# Altium project Sensor_LoRa_Flower_Watchdog.PrjPCB
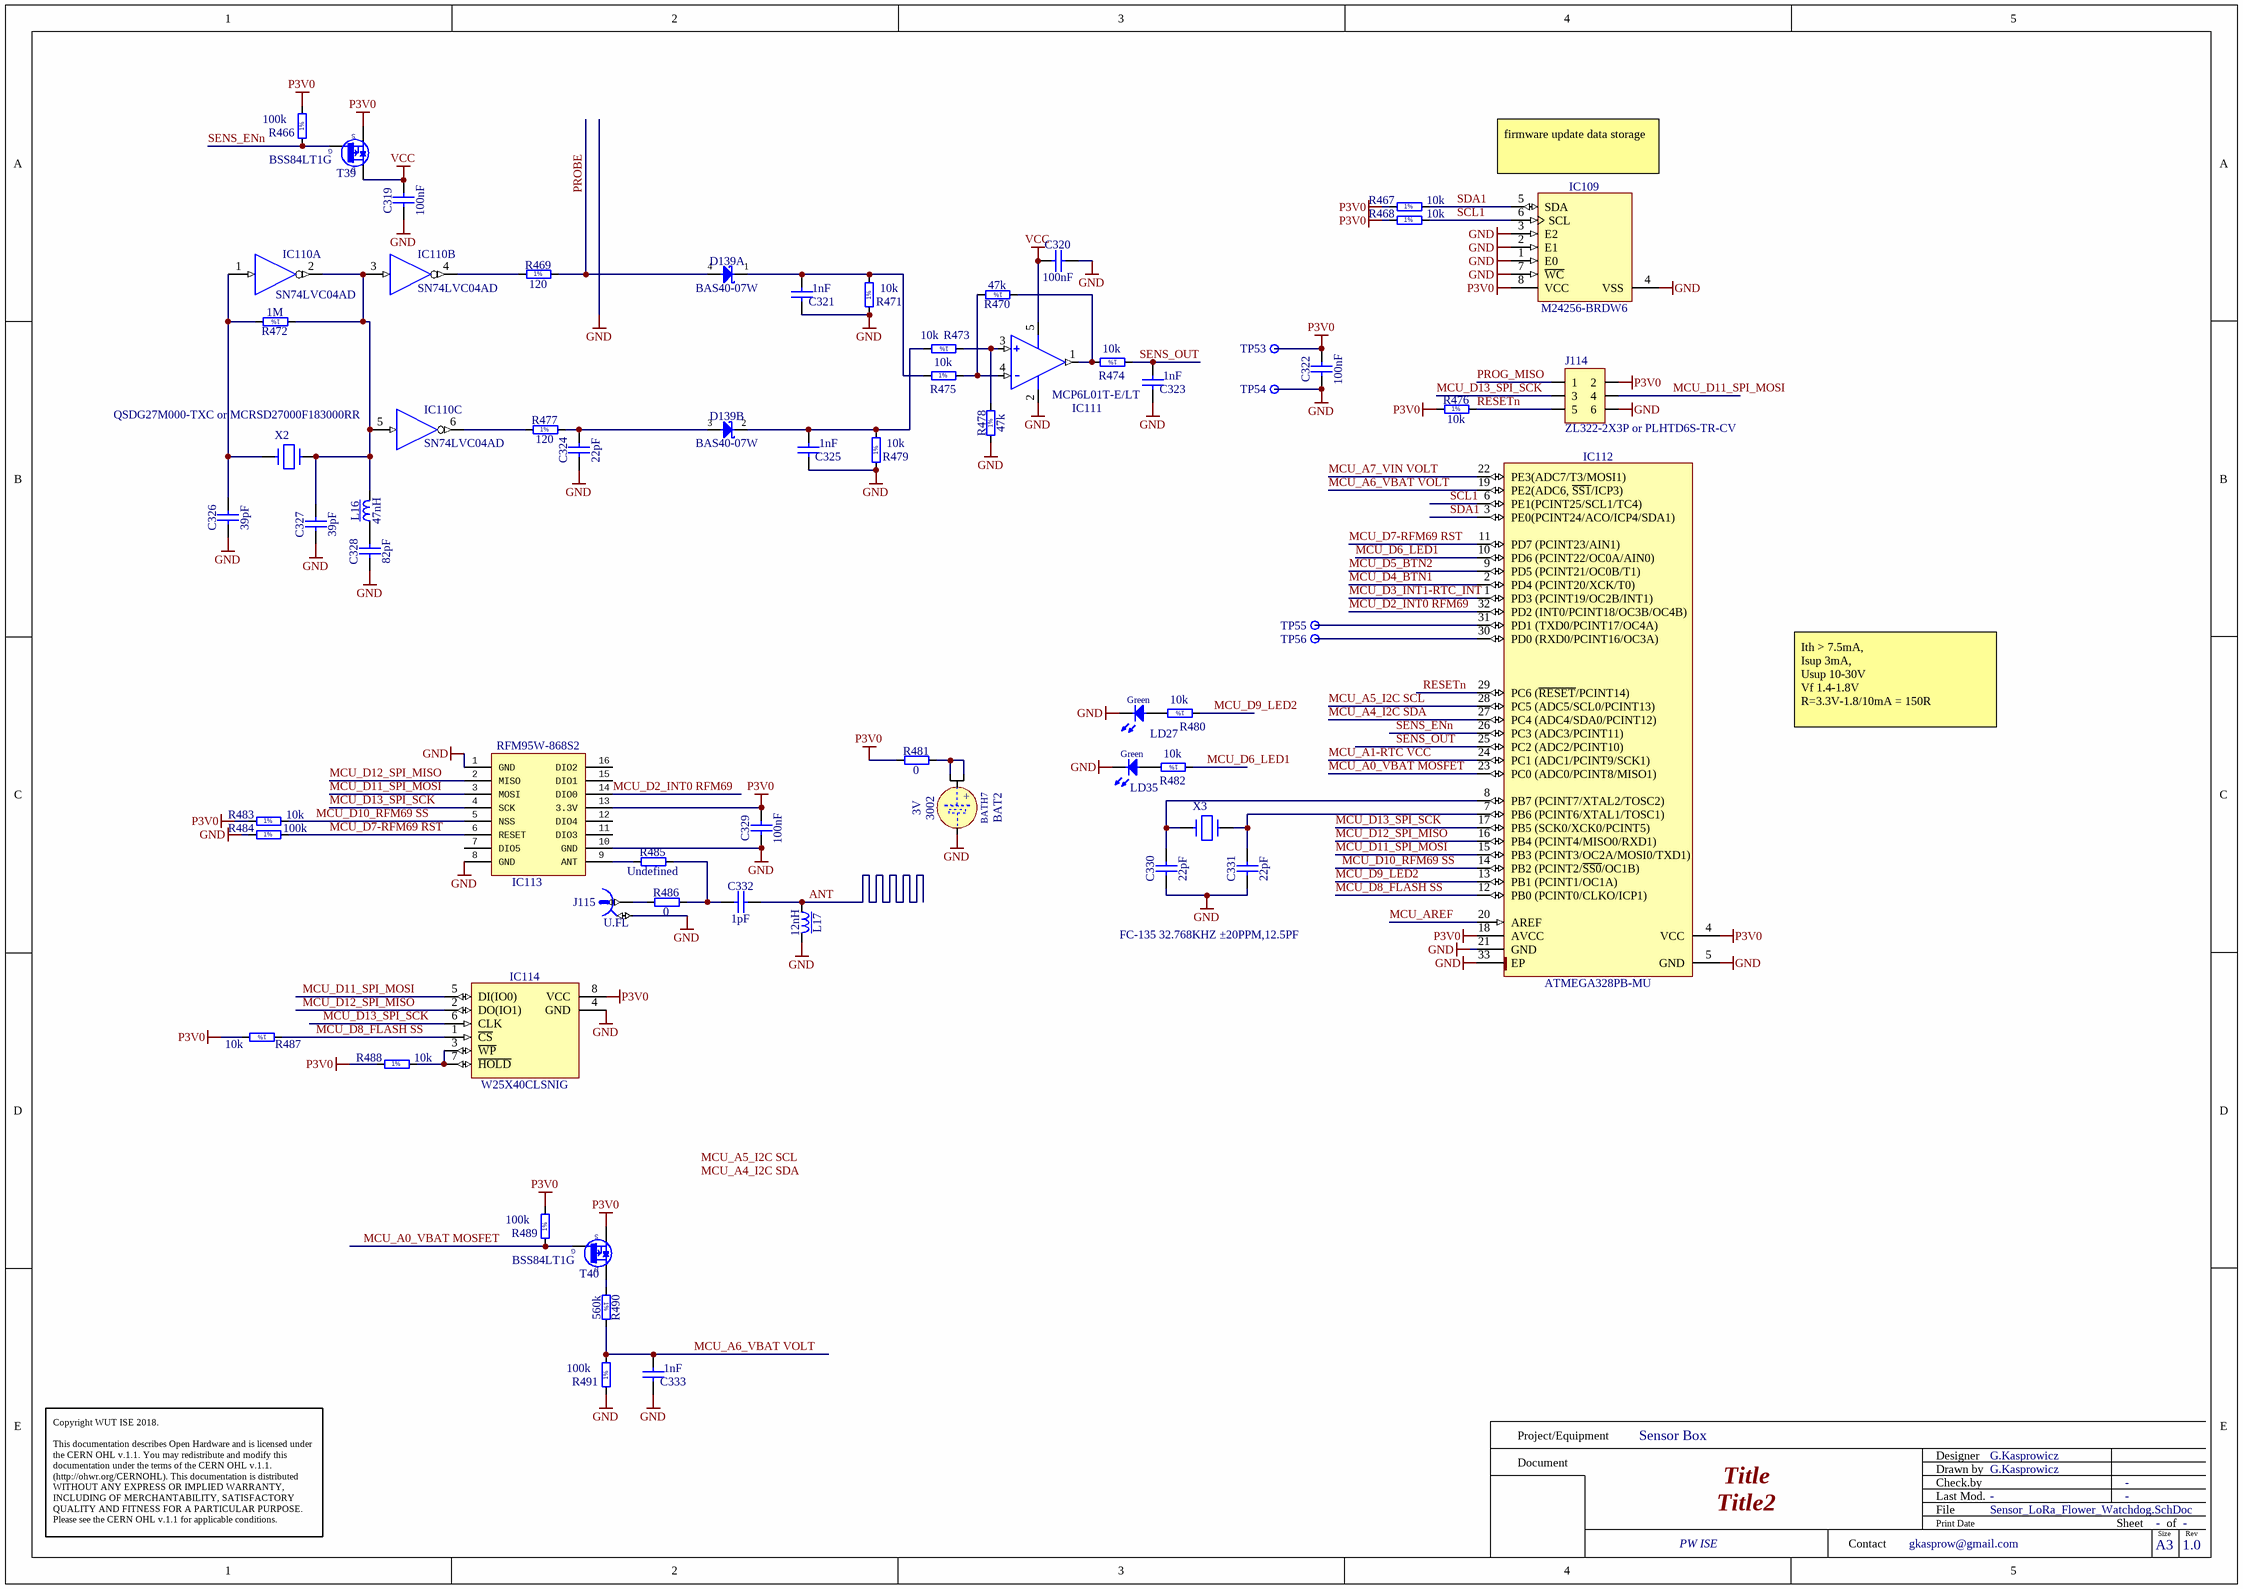
[diagram p0: Sensor_LoRa_Flower_Watchdog.SchDoc]
1 sheet, 64 parts. Net scope: global (net labels, ports and power ports of the same name join across sheets).
Board file: Sensor_LoRa_Flower_Watchdog.PCBDOC

## Sheet Sensor_LoRa_Flower_Watchdog.SchDoc: Title
size 420 x 297 mm; Author: G.Kasprowicz; CompanyName: WUT ISE; DrawnBy: G.Kasprowicz; Organization: WUT ISE; Address1: PW ISE; Address2: Nowowiejska 15/19 00-665 Warsaw; Address3: gkasprow@gmail.com; Revision: 1.0; SheetNumber: -; SheetTotal: -; ModifiedBy: -; CheckedDate: -; Title2: Title2; DivGrp: WUT ISE; Designer: G.Kasprowicz; ModifiedDate: -; ProjectName: Sensor Box

### Parts
BAT2  3V  [BAT_VARTA_CR2032]
BATH7  3002  [KEYSTONE 3002]
C319  100nF  [CAPC1005X55N]
C320  100nF  [CAPC1005X55N]
C321  1nF  [CAPC1005X55N]
C322  100nF  [CAPC1005X55N]
C323  1nF  [CAPC1005X55N]
C324  22pF  [CAPC1005X55N]
C325  1nF  [CAPC1005X55N]
C326  39pF  [CAPC1608X87N]
C327  39pF  [CAPC1608X87N]
C328  82pF  [CAPC2012X90N]
C329  100nF  [CAPC1005X55N]
C330  22pF  [CAPC1005X55N]
C331  22pF  [CAPC1005X55N]
C332  1pF  [CAPC1005X55N]
C333  1nF  [CAPC1005X55N]
D139  BAS40-07W  [INFINEON-PG-SOT343-4]  (parts A,B of 2)
IC109  M24256-BRDW6  [SOP65P640X120-8N]
IC110  SN74LVC04AD  [SOIC127P600X175-14N]  (parts A,B,C of 6)
IC111  MCP6L01T-E/LT  [SC70]
IC112  ATMEGA328PB-MU  [QFN50P500X500X100-33N-S325]
IC113  RFM95W-868S2  [RFM95W]
IC114  W25X40CLSNIG  [SOIC127P600X135-8N]
J114  ZL322-2X3P or PLHTD6S-TR-CV  [ZL322-2X3P]
J115  U.FL  [HIROSE_U.FL-R-SMT-1(10)]
L16  47nH  [IND_COILCRAFT_0805CS]
L17  12nH  [IND_COILCRAFT_0603HP]
LD27  Green  [LED_KINGBRIGHT_KPH-1608CGCK]
LD35  Green  [LED_KINGBRIGHT_KPH-1608CGCK]
R466  100k  [RESC1005X40N]
R467  10k  [RESC1005X40N]
R468  10k  [RESC1005X40N]
R469  120  [RESC1005X40N]
R470  47k  [RESC1005X40N]
R471  10k  [RESC1005X40N]
R472  1M  [RESC1005X40N]
R473  10k  [RESC1005X40N]
R474  10k  [RESC1005X40N]
R475  10k  [RESC1005X40N]
R476  10k  [RESC1005X40N]
R477  120  [RESC1005X40N]
R478  47k  [RESC1005X40N]
R479  10k  [RESC1005X40N]
R480  10k  [RESC1005X40N]
R481  0  [RESC1608X55N]
R482  10k  [RESC1005X40N]
R483  10k  [RESC1005X40N]
R484  100k  [RESC1005X40N]
R485  Undefined  [RESC1608X55N]
R486  0  [RESC1608X55N]
R487  10k  [RESC1005X40N]
R488  10k  [RESC1005X40N]
R489  100k  [RESC1005X40N]
R490  560k  [RESC1005X40N]
R491  100k  [RESC1005X40N]
T39  BSS84LT1G  [SOT95P240X110-3N]
T40  BSS84LT1G  [SOT95P240X110-3N]
TP53  Test Point  [TPS127]  (value not drawn)
TP54  Test Point  [TPS127]  (value not drawn)
TP55  Test Point  [TPS127]  (value not drawn)
TP56  Test Point  [TPS127]  (value not drawn)
X2  QSDG27M000-TXC or MCRSD27000F183000RR  [HC-49SM]
X3  FC-135 32.768KHZ ±20PPM,12.5PF  [XTAL_FC135]

### Nets
GND: BATH7.2(MINUS) C319.1 C320.2 C321.1 C322.1 C323.1 C324.1 C325.1 C326.1 C327.1 C328.1 C329.1 C330.1 C331.1 C333.1 IC109.1(E0) IC109.2(E1) IC109.3(E2) IC109.4(VSS) IC109.7(~{WC}) IC110.7(GND) IC111.2(V-) IC112.5(GND) IC112.21(GND) IC112.33(EP) IC113.1(GND) IC113.8(GND) IC113.10(GND) IC114.4(GND) J114.6 J115.2 L17.2 LD27.1(C) LD35.1(C) R471.1 R478.1 R479.1 R484.1 R491.1 TP54.1
P3V0: C322.2 C329.2 IC109.8(VCC) IC112.4(VCC) IC112.18(AVCC) IC113.13(3.3V) IC114.8(VCC) J114.2 R466.2 R467.1 R468.1 R476.1 R481.1 R483.1 R487.2 R488.1 R489.2 T39.2(S) T40.2(S) TP53.1
VCC: C319.2 C320.1 IC110.14(VCC) IC111.5(V+) T39.3(D)
ANT: C332.2 L17.1
MCU_A0_VBAT MOSFET: IC112.23(PC0_(ADC0/PCINT8/MISO1)) R489.1 T40.1(G)
MCU_A1-RTC VCC: IC112.24(PC1_(ADC1/PCINT9/SCK1))
MCU_A4_I2C SDA: IC112.27(PC4_(ADC4/SDA0/PCINT12))
MCU_A5_I2C SCL: IC112.28(PC5_(ADC5/SCL0/PCINT13))
MCU_A6_VBAT VOLT: C333.2 IC112.19(PE2(ADC6,_~{SS1}/ICP3)) R490.2 R491.2
MCU_A7_VIN VOLT: IC112.22(PE3(ADC7/T3/MOSI1))
MCU_AREF: IC112.20(AREF)
MCU_D2_INT0 RFM69: IC112.32(PD2_(INT0/PCINT18/OC3B/OC4B)) IC113.14(DIO0)
MCU_D3_INT1-RTC_INT: IC112.1(PD3_(PCINT19/OC2B/INT1))
MCU_D4_BTN1: IC112.2(PD4_(PCINT20/XCK/T0))
MCU_D5_BTN2: IC112.9(PD5_(PCINT21/OC0B/T1))
MCU_D6_LED1: IC112.10(PD6_(PCINT22/OC0A/AIN0)) R482.1
MCU_D7-RFM69 RST: IC112.11(PD7_(PCINT23/AIN1)) IC113.6(RESET) R484.2
MCU_D8_FLASH SS: IC112.12(PB0_(PCINT0/CLKO/ICP1)) IC114.1(~{CS}) R487.1
MCU_D9_LED2: IC112.13(PB1_(PCINT1/OC1A)) R480.1
MCU_D10_RFM69 SS: IC112.14(PB2_(PCINT2/~{SS0}/OC1B)) IC113.5(NSS) R483.2
MCU_D11_SPI_MOSI: IC112.15(PB3_(PCINT3/OC2A/MOSI0/TXD1)) IC113.3(MOSI) IC114.5(DI(IO0)) J114.4
MCU_D12_SPI_MISO: IC112.16(PB4_(PCINT4/MISO0/RXD1)) IC113.2(MISO) IC114.2(DO(IO1))
MCU_D13_SPI_SCK: IC112.17(PB5_(SCK0/XCK0/PCINT5)) IC113.4(SCK) IC114.6(CLK) J114.3
PROBE: D139.4(A) R469.2
PROG_MISO: J114.1
RESETn: IC112.29(PC6_(~{RESET}/PCINT14)) J114.5 R476.2
SCL1: IC109.6(SCL) IC112.6(PE1(PCINT25/SCL1/TC4)) R468.2
SDA1: IC109.5(SDA) IC112.3(PE0(PCINT24/ACO/ICP4/SDA1)) R467.2
SENS_ENn: IC112.26(PC3_(ADC3/PCINT11)) R466.1 T39.1(G)
SENS_OUT: C323.2 IC112.25(PC2_(ADC2/PCINT10)) R474.1
NetBATH7_1a: BATH7.1a(PLUS) BATH7.1b(PLUS) R481.2
NetC321_2: C321.2 D139.1(C) R471.2 R475.1
NetC324_2: C324.2 D139.3(C) R477.2
NetC325_2: C325.2 D139.2(A) R473.2 R479.2
NetC326_2: C326.2 IC110.1(A) R472.2 X2.1
NetC327_2: C327.2 IC110.2(~{O}) IC110.3(A) IC110.5(A) L16.2 R472.1 X2.2
NetC328_2: C328.2 L16.1
NetC330_2: C330.2 IC112.8(PB7_(PCINT7/XTAL2/TOSC2)) X3.1
NetC331_2: C331.2 IC112.7(PB6_(PCINT6/XTAL1/TOSC1)) X3.2
NetC332_1: C332.1 R485.2 R486.2
NetIC110_4: IC110.4(~{O}) R469.1
NetIC110_6: IC110.6(~{O}) R477.1
NetIC111_1: IC111.1(OUT) R470.1 R474.2
NetIC111_3: IC111.3(IN+) R473.1 R478.2
NetIC111_4: IC111.4(in-) R470.2 R475.2
NetIC112_30: IC112.30(PD0_(RXD0/PCINT16/OC3A)) TP56.1
NetIC112_31: IC112.31(PD1_(TXD0/PCINT17/OC4A)) TP55.1
NetIC113_9: IC113.9(ANT) R485.1
NetIC114_3: IC114.3(~{WP}) IC114.7(~{HOLD}) R488.2
NetJ115_1: J115.1 R486.1
NetLD27_2: LD27.2(A) R480.2
NetLD35_2: LD35.2(A) R482.2
NetR490_1: R490.1 T40.3(D)

Not connected (* = marked no-connect by the designer): IC113 7(DIO5) 11(DIO3) 12(DIO4) 15(DIO1) 16(DIO2)

### Notes on the sheet
- (near IC109) firmware update data storage
- Ith > 7.5mA,
  Isup 3mA,
  Usup 10-30V
  Vf 1.4-1.8V
  R=3.3V-1.8/10mA = 150R
- Labels drawn without touching a wire or pin: MCU_A4_I2C SDA, MCU_A5_I2C SCL
- Project/Equipment
- Document
- Designer
- Drawn by
- Check.by
- Copyright WUT ISE 2018.
  This documentation describes Open Hardware and is licensed under the CERN OHL v.1.1. You may redistribute and modify this documentation under the terms of the CERN OHL v.1.1. (http://ohwr.org/CERNOHL). This documentation is distributed WITHOUT ANY EXPRESS OR IMPLIED WARRANTY, INCLUDING OF MERCHANTABILITY, SATISFACTORY QUALITY AND FITNESS FOR A PARTICULAR PURPOSE. Please see the CERN OHL v.1.1 for applicable conditions.
- Contact
- File
- Last Mod.
- Print Date
- Sheet
- Size
- A3
- of
- Rev
- (in symbol BAT_VARTA_CR2032) +
- (in symbol BATTERY_HOLD_CR2032_SMD) +
- (in symbol R0402_1M_1%_0.0625W_100PPM) 1%
- (in symbol R0402_10K_1%_0.0625W_100PPM) 1%
- (in symbol R0402_47K_1%_0.0625W_100PPM) 1%
- (in symbol R0402_100K_1%_0.0625W_100PPM) 1%
- (in symbol R0402_120R_1%_0.0625W_100PPM) 1%
- (in symbol R0402_560K_1%_0.0625W_100PPM) 1%

### Library data of the parts
BAT2 = BAT_VARTA_CR2032: Battery for use only with Socket Holder; Part Description: 20x3.2mm Lithium Coin Cells Type CR2032; Manufacturer: VARTA; Manufacturer Part Number: 6032101501; PressFit: No; Power: 230mAh; Part Number: BAT_VARTA_CR2032; Component Kind: Standard; Component Type: Standard; Pin Count: 0; PackageDescription: CR2032, 20mm Diameter x 3.2mm  Height Lithium Coin Cells; Family: Battery; Mounted: Yes; Socket: Yes; SMD: No; Sense: No; Value: 3V; ComponentHeight: 3.2mm; HelpURL: \\cern.ch\dfs\Applications\Altium\Datasheets\BAT_VARTA_CR2032.pdf; Author: CERN DEM JLC; CreateDate: 20/10/2009; LatestRevisionDate: 20/10/2009
BATH7 = BATTERY_HOLD_CR2032_SMD: Battery Holder Keystone 3002; Part Number: BATH_KEYSTONE_3000; Part Description: KEYSTONE 3002 CR2032 BATTERY HOLDER; PressFit: No; Component Kind: Standard; Component Type: Standard; Pin Count: 3; PackageDescription: KEYSTONE 3002 CR2032 BATTERY HOLDER; Family: Battery; Mounted: Yes; Socket: No; SMD: Yes; Sense: No; Manufacturer: KEYSTONE; Manufacturer Part Number: 3002; ComponentHeight: 3.17mm; HelpURL: \\cern.ch\dfs\Applications\Altium\Datasheets\BATH_KEYSTONE_3000.pdf; Author: GK; CreateDate: 17/04/2012; LatestRevisionDate: 07/06/2017
C319 C320 C322 C329 = CC0402_100NF_16V_10%_X5R: Non-polarised capacitor; Part Description: SMD Multilayer Chip Ceramic Capacitor; Manufacturer: GENERIC; Manufacturer1 Part Number: GRM155R61C104KA88D; Voltage: 16V; TC: X5R; Tolerance: ±10%; Part Number: CC0402_100NF_16V_10%_X5R; Component Kind: Standard; Component Type: Standard; Pin Count: 2; Value: 100nF; Status: None; Manufacturer Part Number: CC0402_100NF_16V_10%_X5R; Case: 0402; Mounted: Yes; Socket: No; SMD: Yes; Sense: No; Manufacturer1 Example: MURATA; Manufacturer1 ComponentHeight: 0.55mm; HelpURL: \\cern.ch\dfs\Applications\Altium\Datasheets\CC0402_X5R_MURATA_GRM.pdf; Author: CERN DEM JLC; CreateDate: 10.12.2013; LatestRevisionDate: 10.12.2013
C321 C323 C325 C333 = CC0402_1NF_50V_10%_X7R: Non-polarised capacitor; Part Description: SMD Multilayer Chip Ceramic Capacitor; Manufacturer: GENERIC; Manufacturer1 Part Number: 223858715623; Voltage: 50V; TC: X7R; Tolerance: ±10%; Part Number: CC0402_1NF_50V_10%_X7R; Component Kind: Standard; Component Type: Standard; Pin Count: 2; Value: 1nF; Status: Not Recommended; Manufacturer Part Number: CC0402_1NF_50V_10%_X7R; Case: 0402; Mounted: Yes; Socket: No; SMD: Yes; Sense: No; Manufacturer1 Example: PHYCOMP; Manufacturer1 ComponentHeight: 0.55mm; HelpURL: \\cern.ch\dfs\Applications\Altium\Datasheets\CC0402_X7R_PHYCOMP.pdf; Author: CERN DEM JLC; CreateDate: 03/12/2007; LatestRevisionDate: 03/12/2007
C324 C330 C331 = CC0402_22PF_50V_5%_C0G: Non-polarised capacitor; Part Description: SMD Multilayer Chip Ceramic Capacitor; Manufacturer: GENERIC; Manufacturer1 Part Number: C0402C220J5GACTU; Voltage: 50V; TC: C0G/NP0; Tolerance: ±5%; Part Number: CC0402_22PF_50V_5%_C0G; Component Kind: Standard; Component Type: Standard; Pin Count: 2; Value: 22pF; Status: Preferred; Manufacturer Part Number: CC0402_22PF_50V_5%_C0G; Case: 0402; Mounted: Yes; Socket: No; SMD: Yes; Sense: No; Manufacturer1 Example: KEMET; Manufacturer1 ComponentHeight: 0.55mm; HelpURL: \\cern.ch\dfs\Applications\Altium\Datasheets\CC0805_C0G_KEMET_(Commercial Grade).pdf; Author: CERN DEM JLC; CreateDate: 03/12/2007; LatestRevisionDate: 03/12/2007
C326 C327 = CC0603_39PF_50V_5%_NP0: Non-polarised capacitor; Part Description: SMD Multilayer Chip Ceramic Capacitor; Manufacturer: GENERIC; Manufacturer1 Part Number: 223886715399; Voltage: 50V; TC: C0G/NP0; Tolerance: ±5%; Part Number: CC0603_39PF_50V_5%_NP0; Component Kind: Standard; Component Type: Standard; Pin Count: 2; Value: 39pF; Status: Preferred; Manufacturer Part Number: CC0603_39PF_50V_5%_NP0; Case: 0603; Mounted: Yes; Socket: No; SMD: Yes; Sense: No; Manufacturer1 Example: PHYCOMP; Manufacturer1 ComponentHeight: 0.87mm; HelpURL: \\cern.ch\dfs\Applications\Altium\Datasheets\CC0603_NP0_PHYCOMP.pdf; Author: CERN DEM JLC; CreateDate: 03/12/2007; LatestRevisionDate: 03/12/2007
C328 = CC0805_82PF_100V_1%_NP0_AVX_08051A820FAT2A: Non-polarised capacitor; Part Description: SMD Multilayer Chip Ceramic Capacitor; Manufacturer: AVX; Voltage: 100V; TC: NP0; Tolerance: ±1%; Part Number: CC0805_82PF_100V_1%_NP0_AVX_08051A820FAT2A; Component Kind: Standard; Component Type: Standard; Pin Count: 2; Value: 82pF; Status: Not Recommended; Manufacturer Part Number: 08051A820FAT2A; Case: 0805; Mounted: Yes; Socket: No; SMD: Yes; Sense: No; ComponentHeight: 0.9mm; HelpURL: \\cern.ch\dfs\Applications\Altium\Datasheets\CC0805_C0G_AVX.pdf; Author: CERN DEM WB; CreateDate: 26/07/2016; LatestRevisionDate: 26/07/2016
C332 = CC0402_1PF_50V_0.25PF_C0G: Non-polarised capacitor; Part Description: SMD Multilayer Chip Ceramic Capacitor; Manufacturer: GENERIC; Manufacturer1 Part Number: C0402C109C5GACTU; Voltage: 50V; TC: C0G/NP0; Tolerance: ±0.25pF; Part Number: CC0402_1PF_50V_0.25PF_C0G; Component Kind: Standard; Component Type: Standard; Pin Count: 2; Value: 1pF; Status: Preferred; Manufacturer Part Number: CC0402_1PF_50V_0.25PF_C0G; Case: 0402; Mounted: Yes; Socket: No; SMD: Yes; Sense: No; Manufacturer1 Example: KEMET; Manufacturer1 ComponentHeight: 0.55mm; HelpURL: \\cern.ch\dfs\Applications\Altium\Datasheets\CC0805_C0G_KEMET_(Commercial Grade).pdf; Author: CERN DEM JLC; CreateDate: 03/12/2007; LatestRevisionDate: 22/04/2015
D139 = D_BAS40-07W: Anti-Parallel Pair Schottky Diode; Part Number: BAT15099E6327HTSA1; Manufacturer: INFINEON; Voltage: 4V; Power: 120mA; PressFit: No; Bonding: No; Component Kind: Standard; Component Type: Standard; Device: BAS40-07W; PackageDescription: INFINEON PG-SOT343-4, SOT343, 1.30mm Pitch; 4 Pin,1.25mm W X 2.00mm L X 1.10mm H body, IPC Medium Density; Part Description: Anti-Parallel Pair Schottky Diode; Manufacturer Part Number: BAS40-07W; Pin Count: 4; Case: SOT343; Mounted: Yes; Socket: No; SMD: Yes; Sense: No; ComponentHeight: 1.1mm; HelpURL: \\cern.ch\dfs\Applications\Altium\Datasheets\BAT15099E6327HTSA1.pdf; Author: GK; CreateDate: 28/03/2018; LatestRevisionDate: 28/03/2018
IC109 = MEM_M24256-BRDW6P: 256-Kbit Serial I²C Bus EEPROM; Manufacturer: ST MICROELECTRONICS; PressFit: No; Bonding: No; Part Number: M24256-BRDW6P; Component Kind: Standard; Component Type: Standard; Device: M24256-BRDW6; PackageDescription: SOP, 0.65mm pitch; 8 pin, 4.40mm W X 3.00mm L X 1.20mm H body, IPC Medium Density; Part Description: 256-Kbit Serial I²C Bus EEPROM; Manufacturer Part Number: M24256-BRDW6; Pin Count: 8; Case: TSSOP8; Mounted: Yes; Socket: No; SMD: Yes; Sense: No; ComponentHeight: 1.2mm; HelpURL: \\cern.ch\dfs\Applications\Altium\Datasheets\M24256-BRDW6P.pdf; Author: CERN DEM MR; CreateDate: 17.03.2016; LatestRevisionDate: 17.03.2016
IC110 = SN74LVC04AD: Hex Inverter; Part Description: Hex Inverters; Manufacturer: TEXAS INSTRUMENTS; PressFit: No; Bonding: No; Part Number: SN74LVC04AD; Component Kind: Standard; Component Type: Standard; Device: SN74LVC04AD; PackageDescription: SOIC 14, Pitch 1.27mm - Body 4x8.75mm, IPC Medium Density; Manufacturer Part Number: SN74LVC04AD; Pin Count: 12; Case: SOIC14; Mounted: Yes; Socket: No; SMD: Yes; Sense: No; ComponentHeight: 1.75mm; Author: CERN DEM JLC; HelpURL: \\cern.ch\dfs\Applications\Altium\Datasheets\SN74LVC04AD.pdf; CreateDate: 21/06/2011; LatestRevisionDate: 21/06/2011
IC111 = OA_MCP6001_SC-70: 1 MHz, Low-Power Op Amp
IC112 = UPC_ATMEGA328PB-MU: 8-bit AVR 20MHz Microcontroller With 32K Bytes In-System  Programmable  Flash; Part Description: 8-bit AVR Microcontroller, 32KB Flash, 1KB EEPROM, 2KB SRAM, 32-pin MLF, Industrial Grade (-40°C to 85°C); Manufacturer: ATMEL; PressFit: No; Bonding: No; Part Number: ATMEGA328PB-MU; Component Kind: Standard; Component Type: Standard; Device: ATMEGA328PB-MU; PackageDescription: QFN, (MO-220-VHHD-2) 0.50mm pitch,square; 8 pin X 8 pin, 5mm X 5mm X 1.00mm H body (w/thermal tab 3.25 X 3.25mm),  IPC Medium Density; Manufacturer Part Number: ATMEGA328PB-MU; Pin Count: 33; Case: QFN32; Mounted: Yes; Socket: No; SMD: Yes; Sense: No; ComponentHeight: 1mm; HelpURL: \\cern.ch\dfs\Applications\Altium\Datasheets\ATMEGA328P-MU.pdf; Author: GK; CreateDate: 2011-02-08; LatestRevisionDate: 2014-07-02
IC113 = RF_RFM95W: Low Power LoRa Transceiver Module; Part Description: DC-3GHz Monolithic Amplifier; Manufacturer: HOPE MICROELECTRONICS; PressFit: No; Bonding: No; Part Number: RFM95W-868S2; Component Kind: Standard; Component Type: Standard; Device: RFM95W-868S2; PackageDescription: castellated module; Manufacturer Part Number: RFM95W-868S2; Pin Count: 16; Mounted: Yes; Socket: No; SMD: Yes; Sense: No; ComponentHeight: 1.52mm; Author: GK; HelpURL: \\cern.ch\dfs\Applications\Altium\Datasheets\ERA-4XSM+.pdf; CreateDate: 11.08.2016; LatestRevisionDate: 11.08.2016
IC114 = MEM_W25X40CLSNIG: 4M-bit Serial Flash Memory with uniform 4KB sectors and Dual SPI and QPI; Manufacturer: WINBOND; PressFit: No; Bonding: No; Part Number: W25X40CLSNIG; Component Kind: Standard; Component Type: Standard; Device: W25X40CLSNIG; PackageDescription: SOIC, 8-Leads, Body 4.90x3.90mm, Pitch 1.27mm, IPC Medium Density; Part Description: 4M-bit Serial Flash Memory with uniform 4KB sectors and Dual SPI; Manufacturer Part Number: W25X40CLSNIG; Pin Count: 8; Case: SOIC8; Mounted: Yes; Socket: No; SMD: Yes; Sense: No; ComponentHeight: 2.16mm; HelpURL: \\cern.ch\dfs\Applications\Altium\Datasheets\W25Q128FVSIG.pdf; Author: GK; CreateDate: 26/01/2018; LatestRevisionDate: 26/01/2018
J114 = CON_2x3 1.27 SMT Male: 1.27 mm dual row goldpin (Maritex)
J115 = HIROSE_U.FL-R-SMT-1(10): Part Description: Up to 6GHz Ultra Small Surface Mount Male Coaxial Connectors U.FL Series; Manufacturer: HIROSE (HRS); PressFit: No; Part Number: HIROSE_U.FL-R-SMT-1(10); Component Kind: Standard; Component Type: Standard; Pin Count: 2; Family: U.FL; Mounted: Yes; Socket: No; SMD: Yes; Sense: No; Status: None; Manufacturer Part Number: U.FL-R-SMT-1(10); ComponentHeight: 1.25mm; HelpURL: \\cern.ch\dfs\Applications\Altium\Datasheets\HIROSE_U.FL-R-SMT-1(10).pdf; Author: CERN DEM JLC; CreateDate: 24/03/2010; LatestRevisionDate: 24/03/2010
L16 = IND_47NH_2%_COILCRAFT_0805CS: Inductor With Core; Part Description: SMT Chip Inductor; Manufacturer Part Number: 0805CS-470XGLC; Power: 500mA; Resistance: 0.31R; Tolerance: ±2%; Part Number: IND_47NH_2%_COILCRAFT_0805CS; Component Kind: Standard; Component Type: Standard; Pin Count: 2; Value: 47nH; Status: None; Manufacturer: COILCRAFT; Case: 0805; Mounted: Yes; Socket: No; SMD: Yes; Sense: No; ComponentHeight: 1.52mm; HelpURL: \\cern.ch\dfs\Applications\Altium\Datasheets\IND_COILCRAFT_0805CS.pdf; Author: CERN DEM JLC; CreateDate: 19/08/2013; LatestRevisionDate: 20/08/2013
L17 = L_0603_12NH_2%: Inductor; Part Number: IND0603_12NH_2%_LQW18AN12NG00D; Part Description: Ceramic Chip Inductor; Manufacturer: Murata; Manufacturer Part Number: LQW18AN12NG00D; Power: 0.6A; Resistance: 0.13R; Tolerance: ±2%; Component Kind: Standard; Component Type: Standard; Pin Count: 2; Value: 12nH; Status: None; Case: 0603; Mounted: Yes; Socket: No; SMD: Yes; Sense: No; ComponentHeight: 0.94mm; HelpURL: \\cern.ch\dfs\Applications\Altium\Datasheets\IND0603_COILCRAFT_0603HP.pdf; Author: GK; CreateDate: 09/02/2017; LatestRevisionDate: 09/02/2017
LD27 LD35 = LED_KINGBRIGHT_KPH-1608CGCK: LED Green 1C 2A; Part Description: SMD Green LED, Case 1.6mmX0.8mm(0603), 0.65mm Thickness; PressFit: No; Bonding: No; Part Number: LED_KINGBRIGHT_KPH-1608CGCK; Component Kind: Standard; Component Type: Standard; Color: Green; PackageDescription: SMT Green LED, Case 0603, Body L 1.6 x W 0.8mm H 0.65mm; Manufacturer: KINGBRIGHT; Manufacturer Part Number: KPH-1608CGCK; Pin Count: 2; Mounted: Yes; Socket: No; SMD: Yes; Sense: No; ComponentHeight: 0.65mm; HelpURL: \\cern.ch\dfs\Applications\Altium\Datasheets\LED_KINGBRIGHT_KPH-1608CGCK.pdf; Author: CERN DEM JLC; CreateDate: 03.07.2017; LatestRevisionDate: 03.07.2017
R466 R484 R489 R491 = R0402_100K_1%_0.0625W_100PPM: Resistor - 1%; Part Description: General Purpose Thick Film Chip Resistor; Manufacturer: GENERIC; Manufacturer1 Part Number: 232270671004L; TC: ±100ppm/°C; PressFit: No; Part Number: R0402_100K_1%_0.0625W_100PPM; Component Kind: Standard; Component Type: Standard; Pin Count: 2; Value: 100k; Status: Not Recommended; Power: 0.0625W; Tolerance: ±1%; Manufacturer Part Number: R0402_100K_1%_0.0625W_100PPM; Case: 0402; Mounted: Yes; Sense: No; Socket: No; SMD: Yes; Manufacturer1 Example: YAGEO PHYCOMP; Manufacturer1 ComponentHeight: 0.4mm; HelpURL: \\cern.ch\dfs\Applications\Altium\Datasheets\R0402_Phycomp_RC0402.pdf; Author: CERN DEM JLC; CreateDate: 03/12/2007; LatestRevisionDate: 17/10/2012
R467 R468 R471 R473-R476 R479 R480 R482 R483 R487 R488 = R0402_10K_1%_0.0625W_100PPM: Resistor - 1%; Part Description: General Purpose Thick Film Chip Resistor; Manufacturer: GENERIC; Manufacturer1 Part Number: 232270671003L; TC: ±100ppm/°C; PressFit: No; Part Number: R0402_10K_1%_0.0625W_100PPM; Component Kind: Standard; Component Type: Standard; Pin Count: 2; Value: 10k; Status: Not Recommended; Power: 0.0625W; Tolerance: ±1%; Manufacturer Part Number: R0402_10K_1%_0.0625W_100PPM; Case: 0402; Mounted: Yes; Sense: No; Socket: No; SMD: Yes; Manufacturer1 Example: YAGEO PHYCOMP; Manufacturer1 ComponentHeight: 0.4mm; HelpURL: \\cern.ch\dfs\Applications\Altium\Datasheets\R0402_Phycomp_RC0402.pdf; Author: CERN DEM JLC; CreateDate: 03.12.2007; LatestRevisionDate: 17.10.2012
R469 R477 = R0402_120R_1%_0.0625W_100PPM: Resistor - 1%; Part Description: General Purpose Thick Film Chip Resistor; Manufacturer: GENERIC; Manufacturer1 Part Number: 232270671201L; TC: ±100ppm/°C; PressFit: No; Part Number: R0402_120R_1%_0.0625W_100PPM; Component Kind: Standard; Component Type: Standard; Pin Count: 2; Value: 120; Status: Not Recommended; Power: 0.0625W; Tolerance: ±1%; Manufacturer Part Number: R0402_120R_1%_0.0625W_100PPM; Case: 0402; Mounted: Yes; Sense: No; Socket: No; SMD: Yes; Manufacturer1 Example: YAGEO PHYCOMP; Manufacturer1 ComponentHeight: 0.4mm; HelpURL: \\cern.ch\dfs\Applications\Altium\Datasheets\R0402_Phycomp_RC0402.pdf; Author: CERN DEM JLC; CreateDate: 03/12/2007; LatestRevisionDate: 17/10/2012
R470 R478 = R0402_47K_1%_0.0625W_100PPM: Resistor - 1%; Part Description: General Purpose Thick Film Chip Resistor; Manufacturer: GENERIC; Manufacturer1 Part Number: 232270675103L; TC: ±100ppm/°C; PressFit: No; Part Number: R0402_47K_1%_0.0625W_100PPM; Component Kind: Standard; Component Type: Standard; Pin Count: 2; Value: 47k; Status: Not Recommended; Power: 0.0625W; Tolerance: ±1%; Manufacturer Part Number: R0402_47K_1%_0.0625W_100PPM; Case: 0402; Mounted: Yes; Sense: No; Socket: No; SMD: Yes; Manufacturer1 Example: YAGEO PHYCOMP; Manufacturer1 ComponentHeight: 0.4mm; HelpURL: \\cern.ch\dfs\Applications\Altium\Datasheets\R0402_Phycomp_RC0402.pdf; Author: CERN DEM JLC; CreateDate: 03/12/2007; LatestRevisionDate: 17/10/2012
R472 = R0402_1M_1%_0.0625W_100PPM: Resistor - 1%; Part Description: General Purpose Thick Film Chip Resistor; Manufacturer: GENERIC; Manufacturer1 Part Number: 232270671005L; TC: ±100ppm/°C; PressFit: No; Part Number: R0402_1M_1%_0.0625W_100PPM; Component Kind: Standard; Component Type: Standard; Pin Count: 2; Value: 1M; Status: Not Recommended; Power: 0.0625W; Tolerance: ±1%; Manufacturer Part Number: R0402_1M_1%_0.0625W_100PPM; Case: 0402; Mounted: Yes; Sense: No; Socket: No; SMD: Yes; Manufacturer1 Example: YAGEO PHYCOMP; Manufacturer1 ComponentHeight: 0.4mm; HelpURL: \\cern.ch\dfs\Applications\Altium\Datasheets\R0402_Phycomp_RC0402.pdf; Author: CERN DEM JLC; CreateDate: 03/12/2007; LatestRevisionDate: 17/10/2012
R481 R486 = R0603_0R_JUMPER: Resistor; Part Description: 1A (0.05R Max DC Resistance) Zero Ohm Jumper; Manufacturer: GENERIC; Manufacturer1 Part Number: NRC06Z0; PressFit: No; Part Number: R0603_0R_JUMPER; Component Kind: Standard; Component Type: Standard; Pin Count: 2; Value: 0; Status: Preferred; Manufacturer Part Number: R0603_0R_JUMPER; Case: 0603; Mounted: Yes; Sense: No; Socket: No; SMD: Yes; Manufacturer1 Example: NIC COMPONENT; Manufacturer1 ComponentHeight: 0.55mm; HelpURL: \\cern.ch\dfs\Applications\Altium\Datasheets\R0603_NIC_NRC.pdf; Author: CERN DEM JLC; CreateDate: 03/12/2007; LatestRevisionDate: 13/03/2008
R485 = R0603_NO-VALUE: Resistor; Part Description: Reserved Footprint For a 0603 (1608) Chip Resistor; PressFit: No; Mounted: No; Part Number: R0603_NO-VALUE; Component Kind: Standard; Component Type: Standard; Pin Count: 2; Value: Undefined; Status: None; Manufacturer: Undefined; Manufacturer Part Number: R0603_NO-VALUE; Case: 0603; Sense: No; Socket: No; SMD: Yes; Manufacturer1 Example: Undefined; Manufacturer1 Part Number: Undefined; Manufacturer1 ComponentHeight: Undefined; HelpURL: Undefined; Author: CERN DEM JLC; CreateDate: 03/12/2007; LatestRevisionDate: 13/03/2008
R490 = R0402_560K_1%_0.0625W_100PPM: Resistor - 1%; Part Description: General Purpose Thick Film Chip Resistor; Manufacturer: GENERIC; Manufacturer1 Part Number: 232270675604L; TC: ±100ppm/°C; PressFit: No; Part Number: R0402_560K_1%_0.0625W_100PPM; Component Kind: Standard; Component Type: Standard; Pin Count: 2; Value: 560k; Status: Not Recommended; Power: 0.0625W; Tolerance: ±1%; Manufacturer Part Number: R0402_560K_1%_0.0625W_100PPM; Case: 0402; Mounted: Yes; Sense: No; Socket: No; SMD: Yes; Manufacturer1 Example: YAGEO PHYCOMP; Manufacturer1 ComponentHeight: 0.4mm; HelpURL: \\cern.ch\dfs\Applications\Altium\Datasheets\R0402_Phycomp_RC0402.pdf; Author: CERN DEM JLC; CreateDate: 03/12/2007; LatestRevisionDate: 17/10/2012
T39 T40 = BSS84LT1G: P-CHANNEL MOSFET WITH DIODE; Part Description: 50V 130mA Single P-Channel Power MOSFET; Manufacturer: ON SEMICONDUCTOR; PressFit: No; Bonding: No; Part Number: BSS84LT1G; Component Kind: Standard; Component Type: Standard; Device: BSS84LT1G; PackageDescription: SOT23 3-Leads, Pitch 0.95mm - Body 1.4x3mm, IPC Medium Density; Manufacturer Part Number: BSS84LT1G; Pin Count: 3; Case: SOT23-3; Mounted: Yes; Socket: No; SMD: Yes; Sense: No; ComponentHeight: 1.1mm; HelpURL: \\cern.ch\dfs\Applications\Altium\Datasheets\BSS84LT1G.pdf; Author: CERN DEM JLC; CreateDate: 29.03.2012; LatestRevisionDate: 29.03.2012
TP53-TP56 = SMD_PAD_1.27X1.27MM: Part Description: 1.27mm x 1.27mm PCB Copper Area (SMD Test Point); Mounted: No; Part Number: SMD_PAD_1.27X1.27MM; Component Kind: Standard (No BOM); Component Type: Standard (No BOM); Pin Count: 1; Family: Test Point; Socket: No; SMD: Yes; Sense: No; Status: None; ComponentHeight: 0mm; HelpURL: Undefined; Author: CERN DEM JLC; CreateDate: 12.01.2008; LatestRevisionDate: 12.01.2008; PackageDescription: 1.27mm x 1.27mm PCB Copper Area (SMD Test Point)
X2 = X_CRYSTAL_HC49_SMT_27M: Crystal oscillator; Supplier 1: Newark; Supplier Part Number 1: 56P2844
X3 = X_CRYSTAL_32k_FC-135: 32kHz SMT crystal (EPSON)